# EAGLE design batt_ckt (EAGLE 9.5.0)
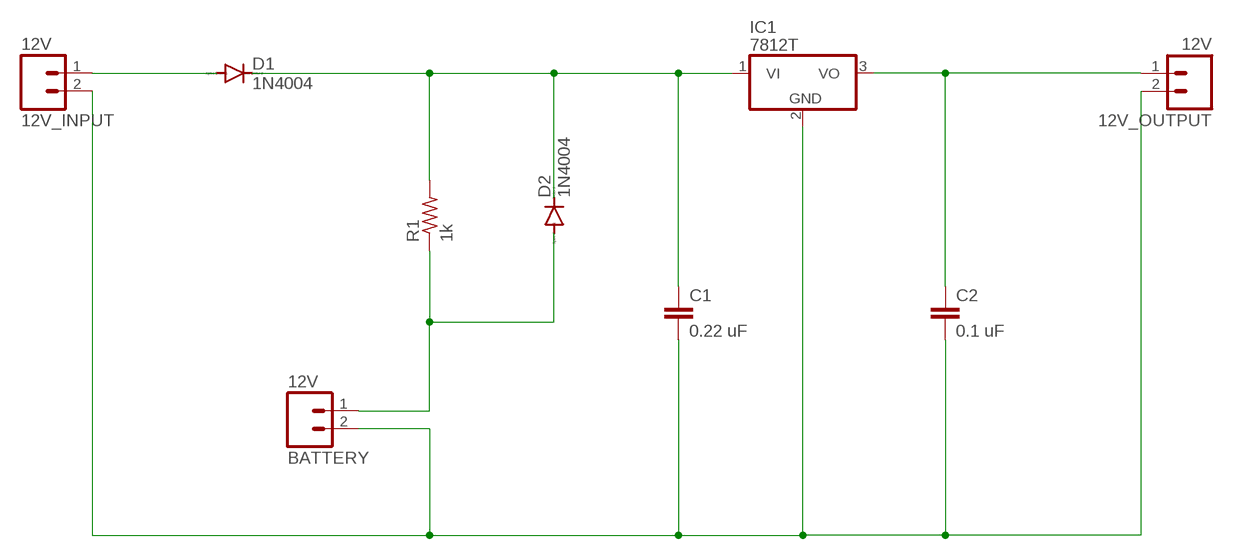
[diagram p0: schematic, sheet 1]

## Parts
12V_INPUT  12V  M02  [02P]
12V_OUTPUT  12V  M02  [02P]
BATTERY  12V  M02  [02P]
C1  0.22 uF  C2.5/5  [C2.5-5]
C2  0.1 uF  C2.5/5  [C2.5-5]
D1  1N4004  [DO41-10]
D2  1N4004  [DO41-10]
IC1  7812T  [TO220H]
R1  1k  R-US_0207/10  [0207/10]

## Nets
N$1: BATTERY.1 D2.A R1.1
N$2: C1.1 D1.C D2.C IC1.1(VI) R1.2
N$3: 12V_INPUT.1 D1.A
N$4: 12V_INPUT.2 12V_OUTPUT.2 BATTERY.2 C1.2 C2.2 IC1.2(GND)
N$6: 12V_OUTPUT.1 C2.1 IC1.3(VO)

## Library data of the parts
12V_INPUT 12V_OUTPUT BATTERY = con-amp-quick:M02: AMP QUICK CONNECTOR; OC_FARNELL: unknown; OC_NEWARK: unknown
C1 C2 = capacitor-wima:C: CAPACITOR naming: grid - package width
D1 D2 = diode:1N4004: DIODE general purpose rectifier, 1 A
IC1 = linear:78*: Positive VOLTAGE REGULATOR Source: http://cache.national.com/ds/LM/LM78L05.pdf http://www.fairchildsemi.com/ds/LM/LM7805.pdf
R1 = rcl:R-US_: RESISTOR, American symbol; SPICEPREFIX: R

## Module INPUT
Ports: 

### Library data of the parts

## Board
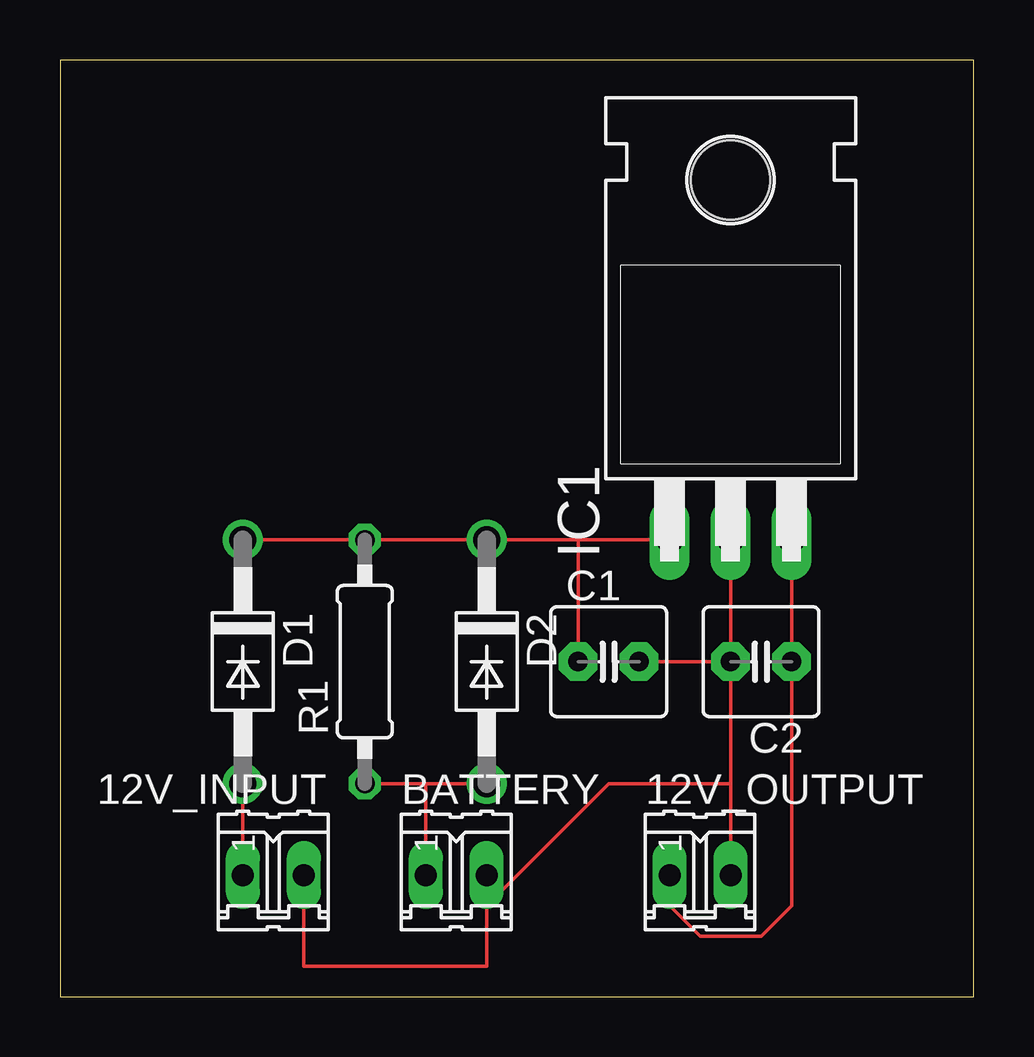
[diagram p1: board, top side]

Size 38.08 x 39.04 mm. Coordinates in mm from the lower left corner, seen from the top.
Outline: 0,0 38.08,0 38.08,39.04 0,39.04 0,0
Copper layers (1*16): Top 0.035mm / dielectric 1.5mm / Bottom 0.035mm
Design rules "default": minimum track width 6mil, minimum drill 0.35mm, track to track 6mil, track to pad 6mil, pad to pad 6mil, via to via 6mil, smd to smd 6mil, copper to edge 40mil, drill to drill 6mil, minimum pad ring 10mil, minimum via ring 8mil, stop-mask expansion 4mil, vias tented up to drill 0mil, thermal gap 10mil

### Footprints (pad centres in the part's own frame; a part is rotated, then mirrored left to right if it is on the bottom)
02P = drill 0.914 long: 1 -1.27,0; 2 1.27,0
C2.5-5 = drill 0.813 pad 1.6 octagon: 1 -1.27,0; 2 1.27,0
DO41-10 = drill 1.118: A 5.08,0; C -5.08,0
TO220H = drill 1.118 long: 1 -2.54,-10.16; 2 0,-10.16; 3 2.54,-10.16 | hole 3.302: 0,4.826
0207/10 = drill 0.813 octagon: 1 -5.08,0; 2 5.08,0

### Placement (x,y rotation side)
12V_INPUT  8.89,5.08 0 top
12V_OUTPUT  26.67,5.08 0 top
BATTERY  16.51,5.08 0 top
C1  22.86,13.97 0 top
C2  29.21,13.97 180 top
D1  7.62,13.97 270 top
D2  17.78,13.97 270 top
IC1  27.94,29.21 0 top
R1  12.7,13.97 90 top

### Tracks (layer width: path | path; a pad name or v marks a point on that pad's centre or on a via)
N$1
  Top 0.152: D2.A 15.24,8.89 | 15.24,8.89 R1.1 | BATTERY.1 15.24,8.89
N$2
  Top 0.152: D1.C R1.2 D2.C 21.59,19.05 | IC1.1 21.59,19.05 | 21.59,19.05 C1.1
N$3
  Top 0.152: 12V_INPUT.1 D1.A
N$4
  Top 0.152: C1.2 C2.2 IC1.2 27.94,8.89 | 12V_OUTPUT.2 27.94,8.89 | 12V_INPUT.2 10.16,1.27 17.78,1.27 17.78,3.81 | BATTERY.2 17.78,3.81 | 27.94,8.89 22.86,8.89 17.78,3.81
N$6
  Top 0.152: 12V_OUTPUT.1 25.4,3.81 26.67,2.54 29.21,2.54 30.48,3.81 IC1.3 C2.1 30.48,12.7